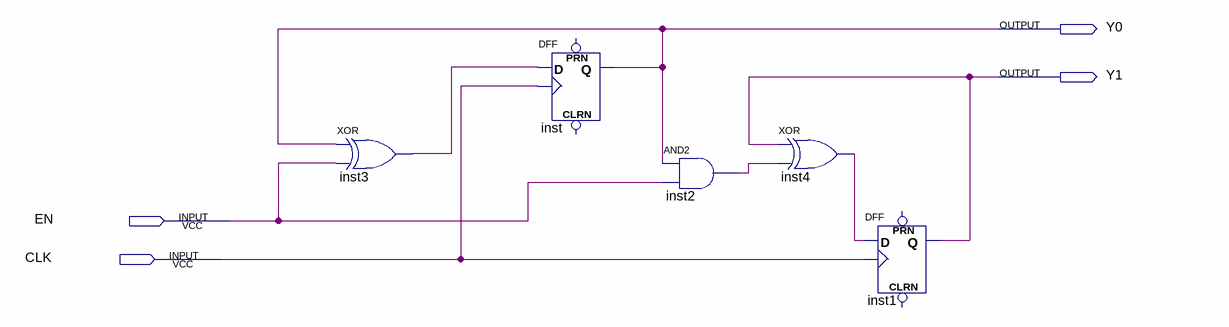
[diagram p0: schematic sheet]
// Quartus schematic Exercicio_3.bdf as structural Verilog: 5 symbols, 4 pins
module Exercicio_3 (
  input  EN,
  input  CLK,
  output Y0,
  output Y1
);

  wire inst2_out, inst3_out, inst4_out;

  xor inst3 (inst3_out, Y0, EN);
  DFF inst (.CLK(CLK), .D(inst3_out), .Q(Y0));  // open: CLRN, PRN
  and inst2 (inst2_out, Y0, EN);
  xor inst4 (inst4_out, Y1, inst2_out);
  DFF inst1 (.CLK(CLK), .D(inst4_out), .Q(Y1));  // open: CLRN, PRN
endmodule
